# EAGLE design clk_module (EAGLE 6.5.0)
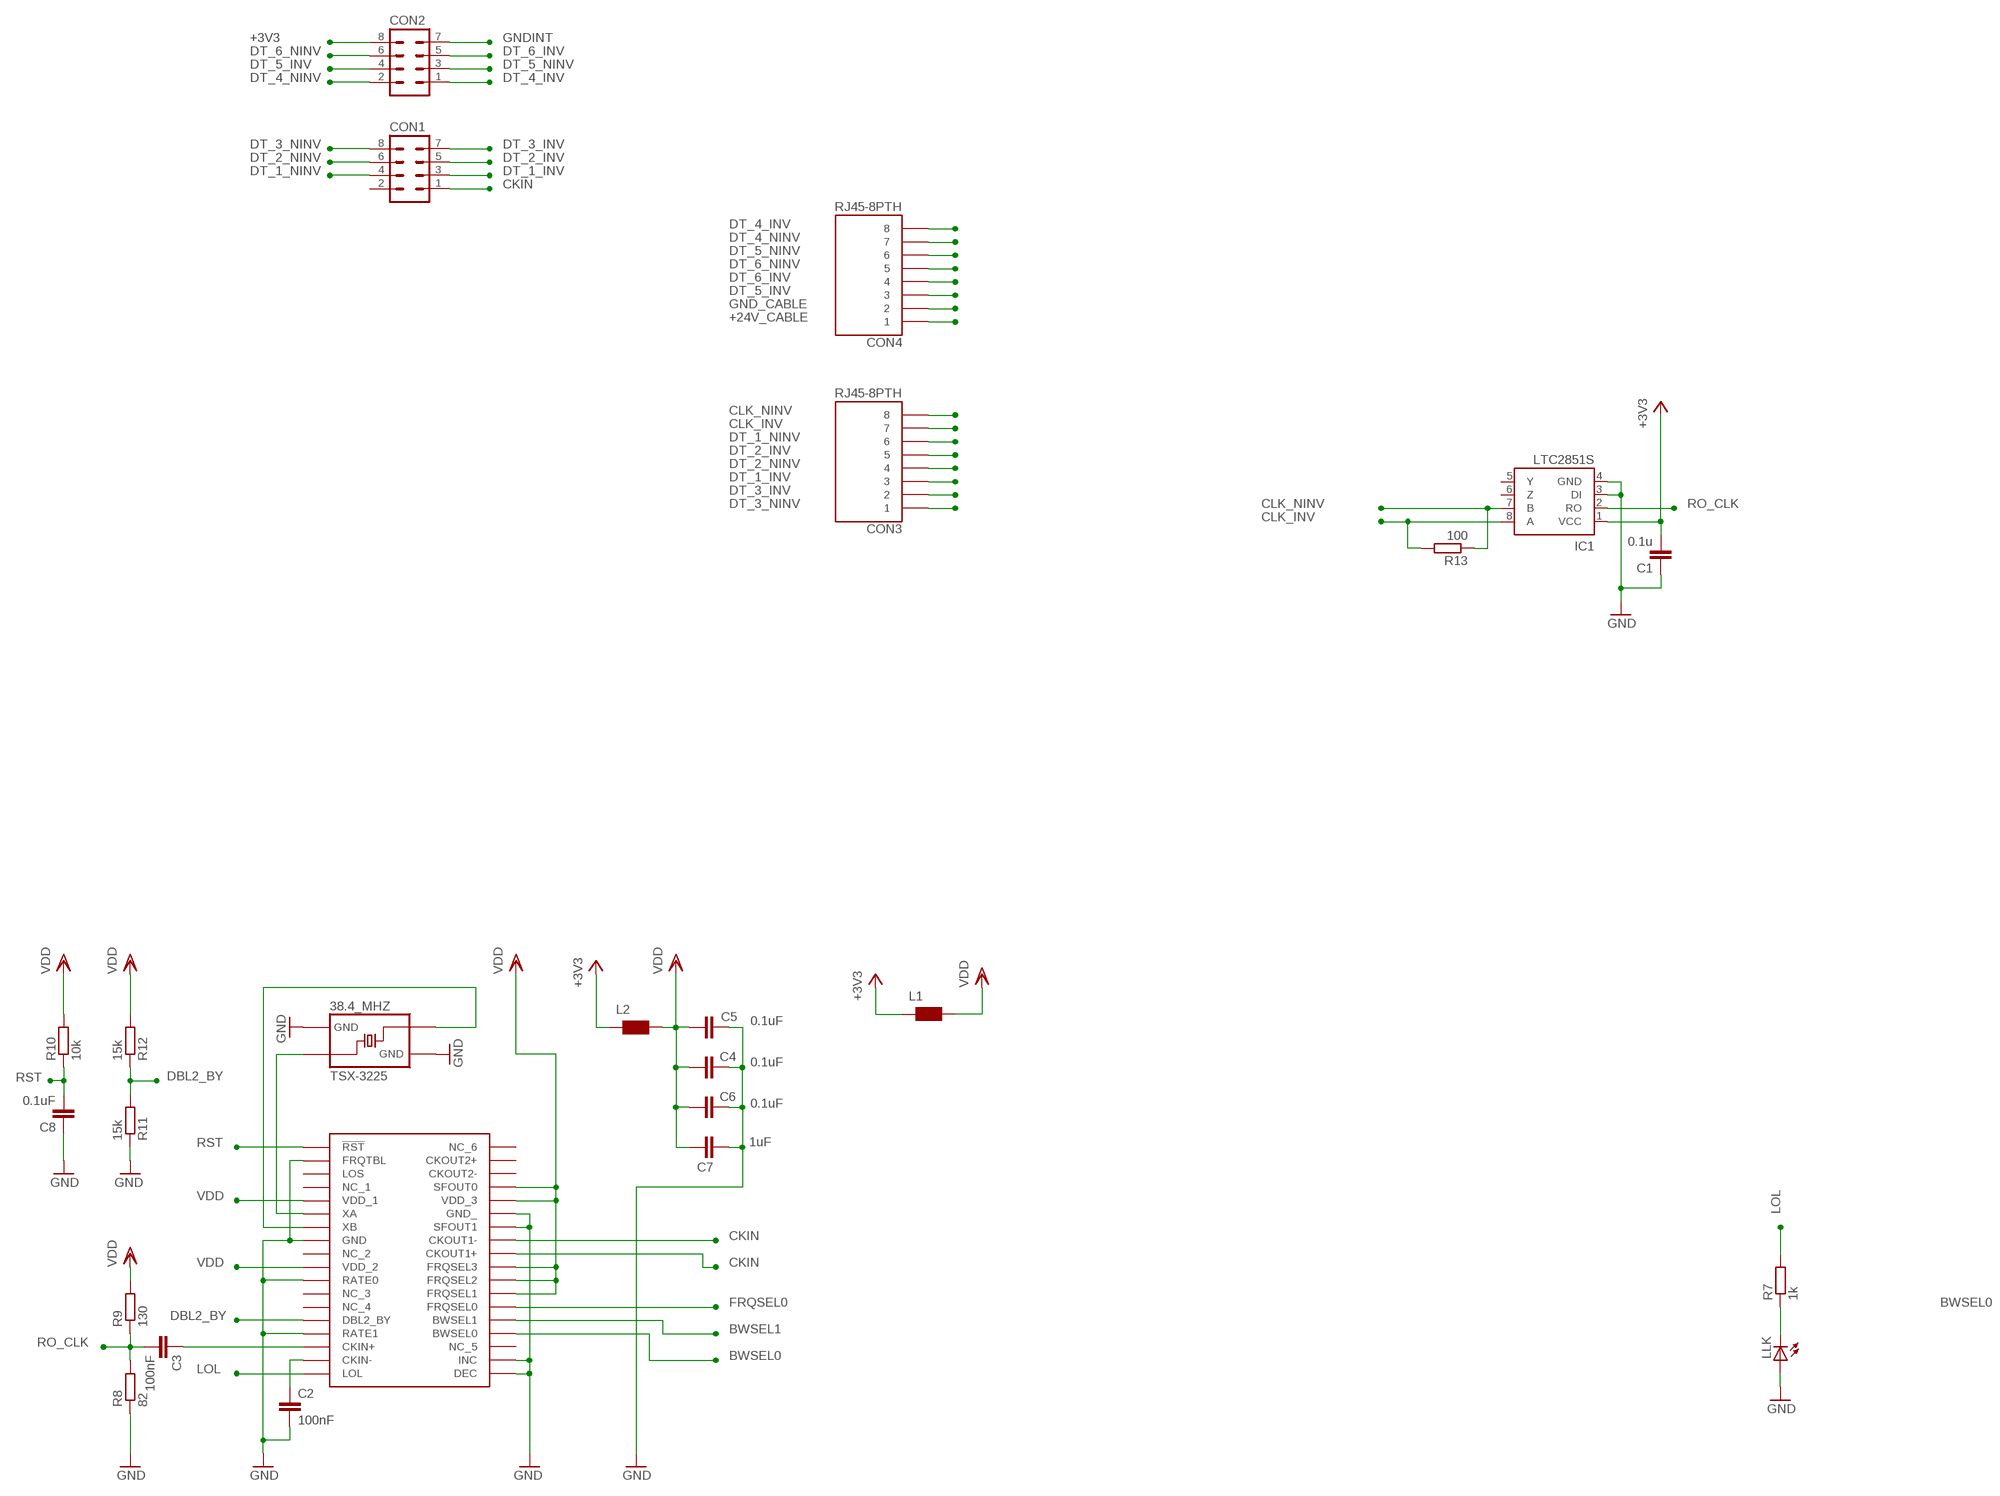
[diagram p0: schematic, sheet 1, part 1 of 2]
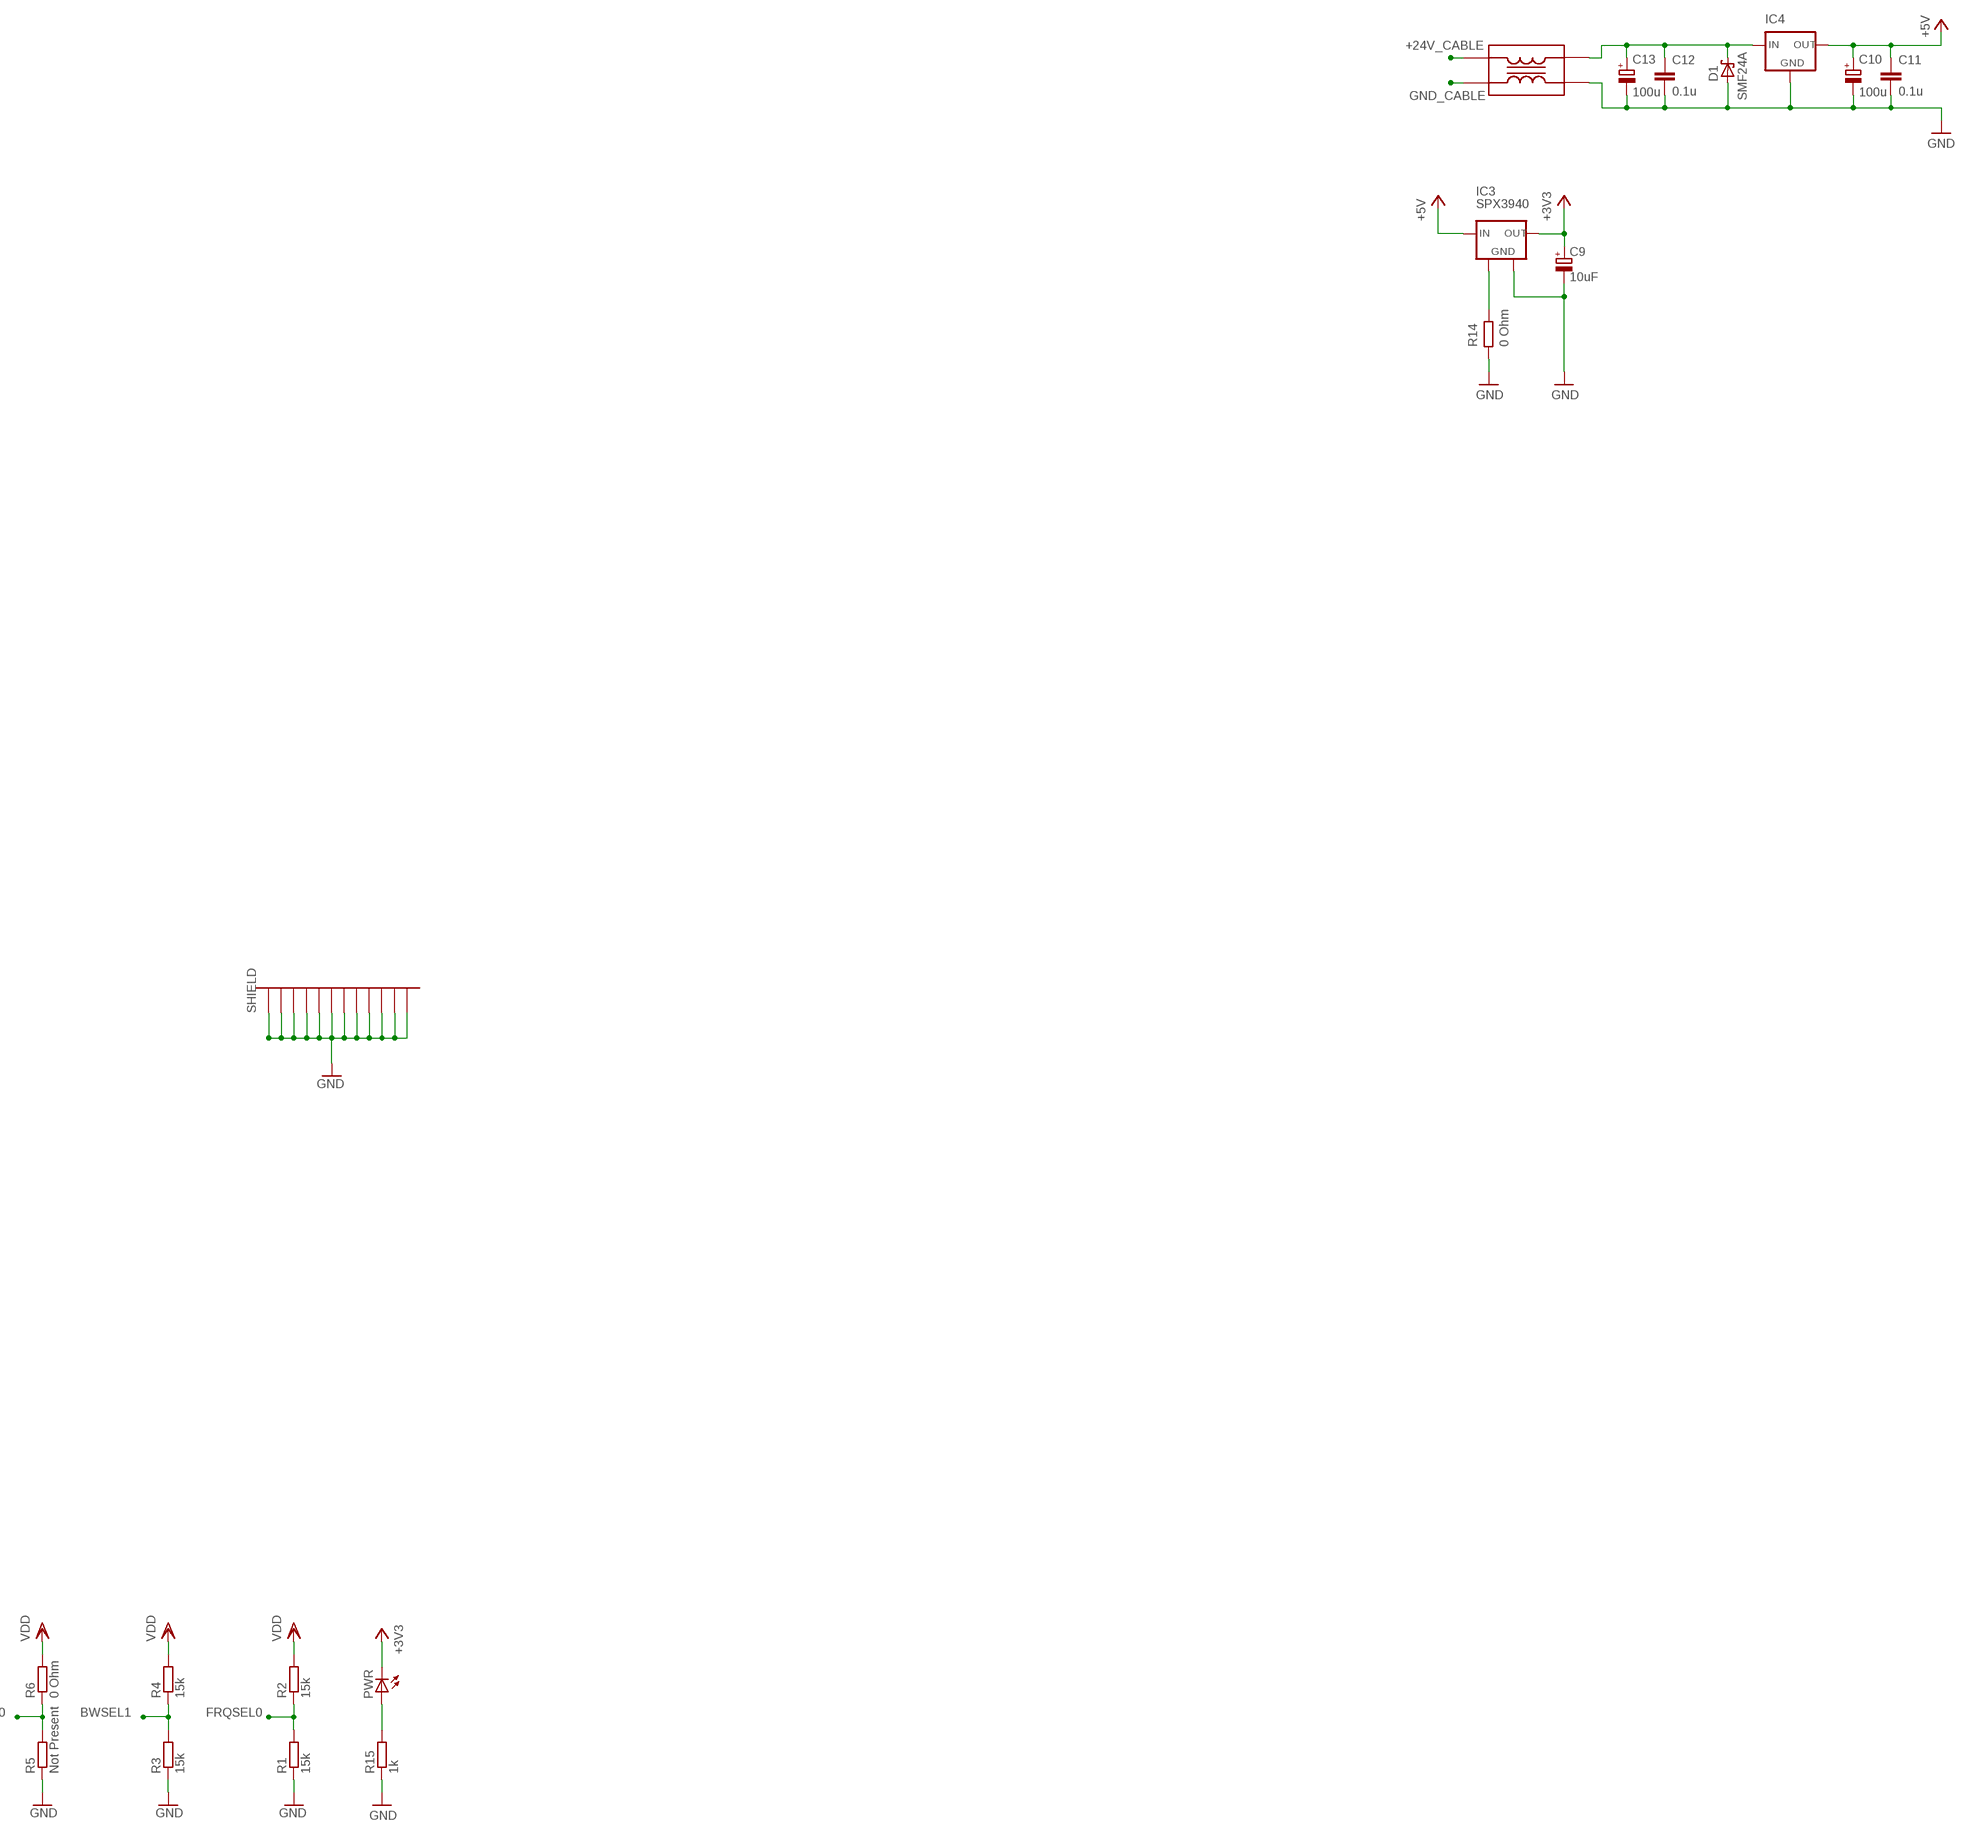
[diagram p1: schematic, sheet 1, part 2 of 2]

## Parts
38.4_MHZ  TSX-3225  [TSX-3225]
C1  0.1u  C-EUC0805  [C0805]
C2  100nF  C-EUC0402  [C0402]
C3  100nF  C-EUC0402  [C0402]
C4  0.1uF  C-EUC0402  [C0402]
C5  0.1uF  C-EUC0402  [C0402]
C6  0.1uF  C-EUC0402  [C0402]
C7  1uF  C-EUC0402  [C0402]
C8  0.1uF  C-EUC0402  [C0402]
C9  10uF  CPOL-EUE2-5  [E2-5]
C10  100u  CPOL-EUE5-10.5  [E5-10,5]
C11  0.1u  C-EUC0805  [C0805]
C12  0.1u  C-EUC0805  [C0805]
C13  100u  CPOL-EUE5-10.5  [E5-10,5]
CON1  MA04-2  [MA04-2]
CON2  MA04-2  [MA04-2]
CON3  RJ45-8PTH  [RJ45-8]
CON4  RJ45-8PTH  [RJ45-8]
D1  SMF24A  [SOD123]
IC1  LTC2851S  [SOIC8]
IC2  SI5317  [QFN-36]
IC3  SPX3940  [SOT223]
IC4  V_REG_OKI-78SRSINK  [TO220-IGO]
L1  WE-CBF_0805  [0805]
L2  WE-CBF_0805  [0805]
L3  ACM3225-601-2P-T001  [ACM3225-601-2P-T001]
LLK  LEDCHIPLED_0805  [CHIPLED_0805]
PWR  LEDCHIPLED_0805  [CHIPLED_0805]
R1  15k  R-EU_R0603  [R0603]
R2  15k  R-EU_R0603  [R0603]
R3  15k  R-EU_R0603  [R0603]
R4  15k  R-EU_R0603  [R0603]
R5  Not Present  R-EU_R0603  [R0603]
R6  0 Ohm  R-EU_R0603  [R0603]
R7  1k  R-EU_R0603  [R0603]
R8  82  R-EU_R0603  [R0603]
R9  130  R-EU_R0603  [R0603]
R10  10k  R-EU_R0402  [R0402]
R11  15k  R-EU_R0603  [R0603]
R12  15k  R-EU_R0603  [R0603]
R13  100  R-EU_R0603  [R0603]
R14  0 Ohm  R-EU_R0805  [R0805]
R15  1k  R-EU_R0603  [R0603]
SH1  BMIS-202  [BMIS-202]

## Nets
24V_IN: C12.1 C13.+ D1.C IC4.IN L3.4
+3V3: C1.2 C9.+ CON2.8 IC1.1(VCC) IC3.3(OUT) L1.1 L2.1 PWR.C
+5V: C10.+ C11.1 IC3.1(IN) IC4.OUT
+24V_CABLE: CON4.1 L3.1
BWSEL0: IC2.22(BWSEL0) R5.2 R6.1
BWSEL1: IC2.23(BWSEL1) R3.2 R4.1
CKIN: CON1.1 IC2.28(CKOUT1+) IC2.29(CKOUT1-)
CKIN+: C3.1 IC2.16(CKIN+)
CKIN-: C2.1 IC2.17(CKIN-)
CLK_INV: CON3.7 IC1.8(A) R13.2
CLK_NINV: CON3.8 IC1.7(B) R13.1
DBL2_BY: IC2.14(DBL2_BY) R11.2 R12.1
DT_1_INV: CON1.3 CON3.3
DT_1_NINV: CON1.4 CON3.6
DT_2_INV: CON1.5 CON3.5
DT_2_NINV: CON1.6 CON3.4
DT_3_INV: CON1.7 CON3.2
DT_3_NINV: CON1.8 CON3.1
DT_4_INV: CON2.1 CON4.8
DT_4_NINV: CON2.2 CON4.7
DT_5_INV: CON2.4 CON4.3
DT_5_NINV: CON2.3 CON4.6
DT_6_INV: CON2.5 CON4.4
DT_6_NINV: CON2.6 CON4.5
FRQSEL0: IC2.24(FRQSEL0) R1.2 R2.1
GND: 38.4_MHZ.PIN_2(GND_2) 38.4_MHZ.PIN_4(GND_1) C1.1 C2.2 C4.1 C5.1 C6.1 C7.1 C8.1 IC1.3(DI) IC1.4(GND) IC2.2(FRQTBL) IC2.8(GND) IC2.11(RATE0) IC2.15(RATE1) IC2.19(DEC) IC2.20(INC) IC2.30(SFOUT1) IC2.31(GND_) LLK.A R1.1 R3.1 R5.1 R8.1 R11.1 R14.1 SH1.P$1(GND) SH1.P$2(GND) SH1.P$3(GND) SH1.P$4(GND) SH1.P$5(GND) SH1.P$6(GND) SH1.P$7(GND) SH1.P$8(GND) SH1.P$9(GND) SH1.P$10(GND) SH1.P$11(GND) SH1.P$12(GND)
GND_CABLE: CON4.2 L3.2
GNDINT: C9.- C10.- C11.2 C12.2 C13.- CON2.7 D1.A IC3.2(GND) IC3.4(GND) IC4.GND L3.3 R14.2 R15.1 ; supply symbol labelled GND
LOL: IC2.18(LOL) R7.2
N$1: PWR.A R15.2
N$11: LLK.C R7.1
RO_CLK: C3.2 IC1.2(RO) R8.2 R9.1
RST: C8.2 IC2.1(!RST) R10.1
VDD: C4.2 C5.2 C6.2 C7.2 IC2.5(VDD_1) IC2.10(VDD_2) IC2.25(FRQSEL1) IC2.26(FRQSEL2) IC2.27(FRQSEL3) IC2.32(VDD_3) IC2.33(SFOUT0) L2.2 R10.2 R12.2
VDD_2: L1.2 R2.2 R4.2 R6.2 R9.2 ; supply symbol labelled VDD
XA: 38.4_MHZ.PIN_1(CON_1) IC2.6(XA)
XB: 38.4_MHZ.PIN_3(CON_2) IC2.7(XB)
Unconnected: CON1.2 IC1.5(Y) IC1.6(Z) IC2.3(LOS) IC2.4(NC_1) IC2.9(NC_2) IC2.12(NC_3) IC2.13(NC_4) IC2.21(NC_5) IC2.34(CKOUT2-) IC2.35(CKOUT2+) IC2.36(NC_6)

## Power pins joined to a net without a drawn wire
GND: IC2.GND_PAD(GND) IC2.GND_VIA_1(GND) IC2.GND_VIA_2(GND) IC2.GND_VIA_3(GND) IC2.GND_VIA_4(GND) IC2.GND_VIA_5(GND)

## Library data of the parts
38.4_MHZ = texas_lvds:TSX-3225: MHz Range Crystal Unit Miniature Size Low Profile SMD
C1-C8 C11 C12 = rcl:C-EU: CAPACITOR, European symbol
C9 C10 C13 = rcl:CPOL-EU: POLARIZED CAPACITOR, European symbol
CON1 CON2 = con-lstb:MA04-2: PIN HEADER; OC_FARNELL: unknown; OC_NEWARK: unknown
CON3 CON4 = SparkFun:RJ45-8: RJ45 Jack Simple RJ45, 8-pin connection - connector for common Cat5, Cat5e, and Cat6 Ethernet cables. Footprint not yet proven in production. Connector sku is PRT-00643; Breakout PCB sku is BOB-00716.
D1 = texas_lvds:SMF24A: TVS DIODE 200W SOD-123F 24V UNI by Littelfuse Inc
IC1 = texas_lvds:LTC2851: 3.3V 20Mbps RS485/RS422 Transceiver - Full Duplex no Enable Source: http://cds.linear.com/docs/Datasheet/285012fd.pdf
IC2 = texas_lvds:SI5317: Jitter attenuation without clock multiplication.
IC3 = texas_lvds:SPX3940: Voltage regulator with a low drop out voltage of 280mV (typical) at 1A
IC4 = texas_lvds:V_REG_OKI-78SR: Voltage Regulator Standard 7805 5V regulator. IGO (Input Ground Output). Spark Fun Electronics SKU : COM-00107
L1 L2 = wuerth-elektronik:WE-CBF: SMD EMI Suppression Ferrite Beads - excellent anti-EMI properties - low DCR - impedances till 3000 ohms - rated current up to 6 A
L3 = texas_lvds:ACM3225-601-2P-T001: TDK Common Mode Filter For High-speed Differential Signal Line / General Signal Line
LLK PWR = led:LED: LED OSRAM: - CHIPLED LG R971, LG N971, LY N971, LG Q971, LY Q971, LO R971, LY R971 LH N974, LH R974 LS Q976, LO Q976, LY Q976 LO Q996 - Hyper CHIPLED LW Q18S LB Q993, LB Q99A, LB R99A - SideLED LS A670, LO A670, LY A670, LG A670, LP A670 LB A673, LV A673, LT A673, LW A673 LH A674 LY A675 LS A676, LA A676, LO A676, LY A676, LW A676 LS A679, LY A679, LG A679 - Hyper Micro SIDELED® LS Y876, LA Y876, LO Y876, LY Y876 LT Y87S - SmartLED LW L88C, LW L88S LB L89C, LB L89S, LG L890 LS L89K, LO L89K, LY L89K LS L896, LA L896, LO L896, LY L896 - TOPLED LS T670, LO T670, LY T670, LG T670, LP T670 LSG T670, LSP T670, LSY T670, LOP T670, LYG T670 LG T671, LOG T671, LSG T671 LB T673, LV T673, LT T673, LW T673 LH T674 LS T676, LA T676, LO T676, LY T676, LB T676, LH T676, LSB T676, LW T676 LB T67C, LV T67C, LT T67C, LS T67K, LO T67K, LY T67K, LW E67C LS E67B, LA E67B, LO E67B, LY E67B, LB E67C, LV E67C, LT E67C LW T67C LS T679, LY T679, LG T679 LS T770, LO T770, LY T770, LG T770, LP T770 LB T773, LV T773, LT T773, LW T773 LH T774 LS E675, LA E675, LY E675, LS T675 LS T776, LA T776, LO T776, LY T776, LB T776 LHGB T686 LT T68C, LB T68C - Hyper Mini TOPLED® LB M676 - Mini TOPLED Santana® LG M470 LS M47K, LO M47K, LY M47K Source: http://www.osram.convergy.de LUXEON: - LUMILED® LXK2-PW12-R00, LXK2-PW12-S00, LXK2-PW14-U00, LXK2-PW14-V00 LXK2-PM12-R00, LXK2-PM12-S00, LXK2-PM14-U00 LXK2-PE12-Q00, LXK2-PE12-R00, LXK2-PE12-S00, LXK2-PE14-T00, LXK2-PE14-U00 LXK2-PB12-K00, LXK2-PB12-L00, LXK2-PB12-M00, LXK2-PB14-N00, LXK2-PB14-P00, LXK2-PB14-Q00 LXK2-PR12-L00, LXK2-PR12-M00, LXK2-PR14-Q00, LXK2-PR14-R00 LXK2-PD12-Q00, LXK2-PD12-R00, LXK2-PD12-S00 LXK2-PH12-R00, LXK2-PH12-S00 LXK2-PL12-P00, LXK2-PL12-Q00, LXK2-PL12-R00 Source: www.luxeon.com KINGBRIGHT: KA-3528ASYC Source: www.kingbright.com
R1-R6 R8 R9 R11 R12 = resistor:R-EU_: RESISTOR, European symbol
R7 R10 R13-R15 = rcl:R-EU_: RESISTOR, European symbol
SH1 = laird:BMIS-202: Laird BMI-S-202 EMI Shield

## Board
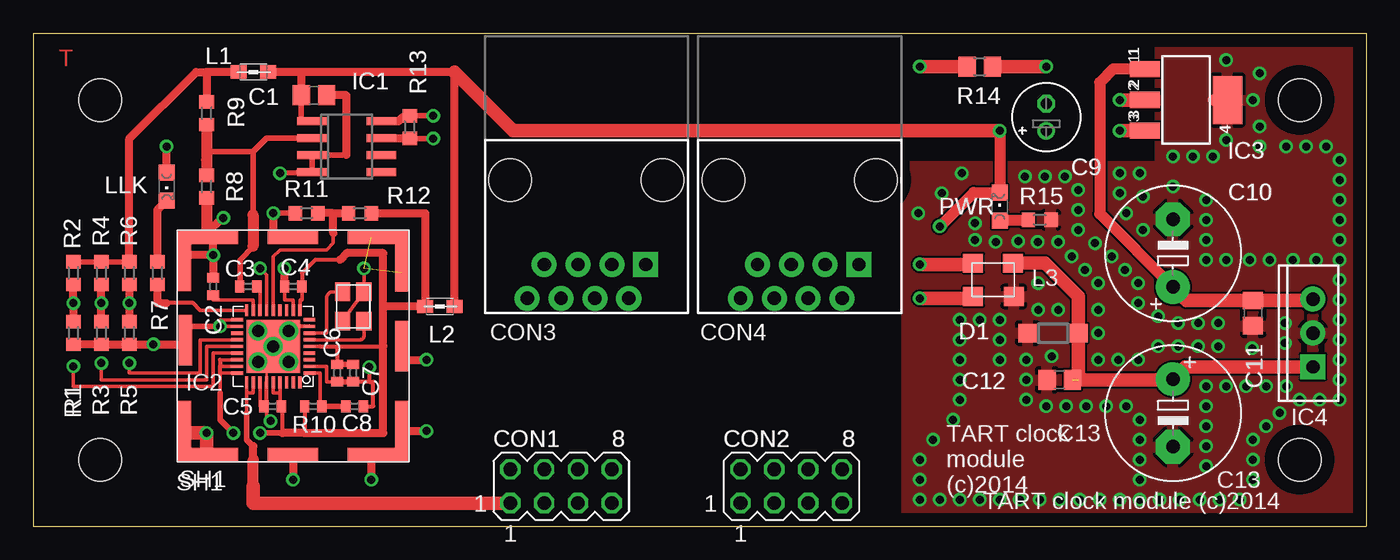
[diagram p2: board, top side]
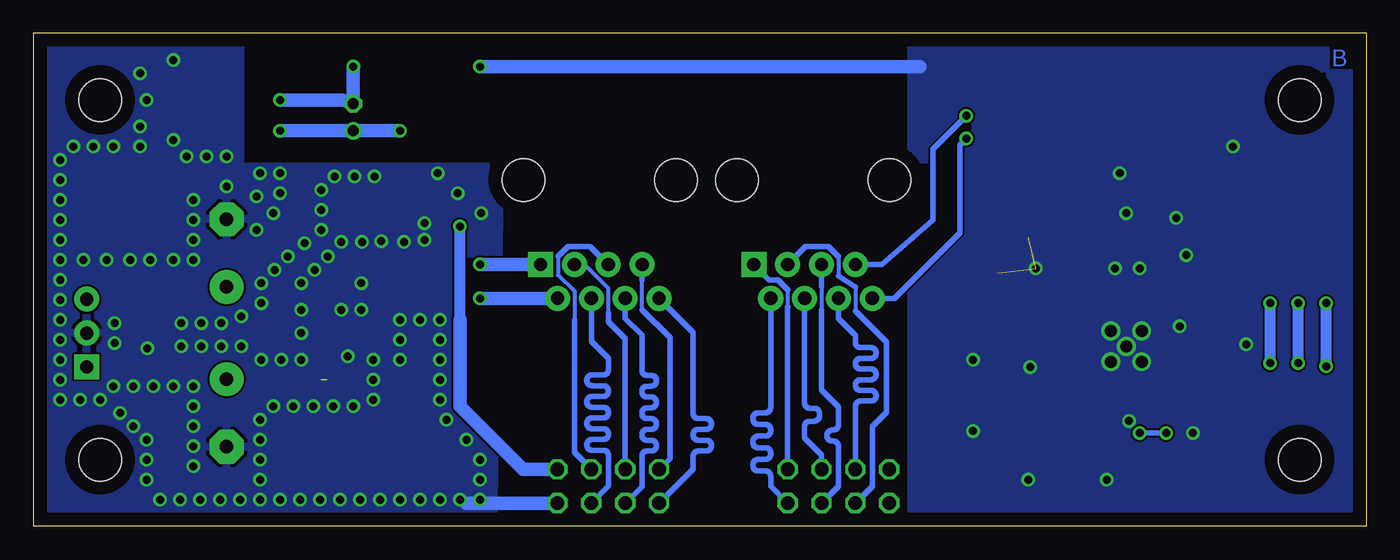
[diagram p3: board, bottom side, seen from below]

Size 100 x 37 mm. Coordinates in mm from the lower left corner, seen from the top.
Outline: 0,37 0,0 100,0 100,37 0,37
Copper layers (1*16): Top 0.035mm / dielectric 1.5mm / Bottom 0.035mm
Design rules "default *": minimum track width 0.25mm, minimum drill 0.6mm, track to track 6mil, track to pad 6mil, pad to pad 6mil, via to via 6mil, smd to smd 6mil, copper to edge 40mil, drill to drill 8mil, minimum pad ring 10mil, minimum via ring 8mil, stop-mask expansion 4mil, vias tented up to drill 0.7mm, thermal gap 10mil
Holes 3.2 mm at 5,5 5,32 95,5 95,32

### Footprints (pad centres in the part's own frame; a part is rotated, then mirrored left to right if it is on the bottom)
TSX-3225 = smd 1.4 x 1.15: PIN_1 -1.1,-0.8; PIN_2 1.1,-0.8; PIN_3 1.1,0.8; PIN_4 -1.1,0.8
C0805 = smd 1.3 x 1.5: 1 -0.95,0; 2 0.95,0
C0402 = smd 0.7 x 0.9: 1 -0.65,0; 2 0.65,0
E2-5 = drill 0.813 pad 1.27: + -1.016,0 | drill 0.813 pad 1.27 octagon: - 1.016,0
E5-10,5 = drill 1.016 pad 2.54: + -2.54,0 | drill 1.016 pad 2.54 octagon: - 2.54,0
MA04-2 = drill 1.016 octagon: 1 -3.81,-1.27; 2 -3.81,1.27; 3 -1.27,-1.27; 4 -1.27,1.27; 5 1.27,-1.27; 6 1.27,1.27; 7 3.81,-1.27; 8 3.81,1.27
RJ45-8 = drill 1 pad 1.88 square: 1 -4.445,6.35 | drill 1 pad 1.88: 2 -3.175,8.89; 3 -1.905,6.35; 4 -0.635,8.89; 5 0.635,6.35; 6 1.905,8.89; 7 3.175,6.35; 8 4.445,8.89 | hole 3.2: -5.715,0; 5.715,0
SOD123 = smd 1.4 x 1.4: A 1.9,0; C -1.9,0
SOIC8 = smd 0.6 x 2.2: 1 -1.905,-2.6; 2 -0.635,-2.6; 3 0.635,-2.6; 4 1.905,-2.6; 5 1.905,2.6; 6 0.635,2.6; 7 -0.635,2.6; 8 -1.905,2.6
QFN-36 = smd 0.89 x 0.25: 1 -2.71,2; 2 -2.71,1.5; 3 -2.71,1; 4 -2.71,0.5; 5 -2.71,0; 6 -2.71,-0.5; 7 -2.71,-1; 8 -2.71,-1.5; 9 -2.71,-2; 19 2.71,-2; 20 2.71,-1.5; 21 2.71,-1; 22 2.71,-0.5; 23 2.71,0; 24 2.71,0.5; 25 2.71,1; 26 2.71,1.5; 27 2.71,2 | smd 0.25 x 0.89: 10 -2,-2.71; 11 -1.5,-2.71; 12 -1,-2.71; 13 -0.5,-2.71; 14 0,-2.71; 15 0.5,-2.71; 16 1,-2.71; 17 1.5,-2.71; 18 2,-2.71; 28 2,2.71; 29 1.5,2.71; 30 1,2.71; 31 0.5,2.71; 32 0,2.71; 33 -0.5,2.71; 34 -1,2.71; 35 -1.5,2.71; 36 -2,2.71 | smd 4 x 4: GND_PAD 0,0 | drill 0.9: GND_VIA_1 -1.15,1.15; GND_VIA_2 1.15,1.15; GND_VIA_3 0,0; GND_VIA_4 -1.15,-1.15; GND_VIA_5 1.15,-1.15
SOT223 = smd 1.219 x 2.235: 1 -2.311,-3.099; 2 0,-3.099; 3 2.311,-3.099 | smd 3.6 x 2.2: 4 0,3.099
TO220-IGO = drill 1 pad 1.88: GND 0,0; OUT 2.54,0 | drill 1 pad 1.88 square: IN -2.54,0
0805 = smd 1.2 x 1: 1 -1.1,0; 2 1.1,0
ACM3225-601-2P-T001 = smd 1.5 x 1.4: 1 -1.5,1.25; 2 -1.5,-1.25; 3 1.55,-1.25; 4 1.5,1.25
CHIPLED_0805 = smd 1.2 x 1.2: A 0,-1.05; C 0,1.05
R0603 = smd 1 x 1.1: 1 -0.85,0; 2 0.85,0
R0402 = smd 0.7 x 0.9: 1 -0.65,0; 2 0.65,0
R0805 = smd 1.3 x 1.5: 1 -0.95,0; 2 0.95,0
BMIS-202 = smd 1 x 4.55: P$1 -7.675,-6.35; P$2 -7.675,6.425; P$3 8.625,6.4; P$4 8.625,-6.35 | smd 1 x 3.8: P$5 -7.6,0.475; P$7 8.625,0.025 | smd 3.8 x 1: P$6 0.475,8.2; P$8 0.475,-8.125 | smd 3.55 x 1: P$9 -5.4,-8.125; P$10 -5.4,8.2; P$11 6.35,8.175; P$12 6.35,-8.125

### Placement (x,y rotation side)
38.4_MHZ  24,16.5 90 top
C1  21.06,32.34 180 top
C2  13.5,18 90 top
C3  16.14,18 180 top
C4  19.5,18 0 top
C5  17.95,9 0 top
C6  22.8,11.5 90 top
C7  24,11.5 90 top
C8  24.1,9 180 top
C9  76,30.7 90 top
C10  85.5,20.5 90 top
C11  91.5,16 270 top
C12  77,11 180 top
C13  85.5,8.5 270 top
CON1  39.59,3 0 top
CON2  56.87,3 0 top
CON3  41.5,26 180 top
CON4  57.5,26 180 top
D1  76.5,14.5 180 top
IC1  23.5,28.5 270 top
IC2  18,13.5 180 top
IC3  86.5,32 270 top
IC4  96,14.5 90 top
L1  16.5,34.1 180 top
L2  30.5,16.5 180 top
L3  72,18.5 0 top
LLK  10,25.5 180 top
PWR  72.5,24 0 top
R1  3,14.5 90 top
R2  3,19 90 top
R3  5.1,14.5 90 top
R4  5.1,19 90 top
R5  7.2,14.5 90 top
R6  7.2,19 90 top
R7  9.3,19 270 top
R8  13,25.5 90 top
R9  13,31 90 top
R10  21,9 180 top
R11  20.5,23.5 0 top
R12  24.5,23.5 0 top
R13  28.24,29.96 90 top
R14  71,34.5 0 top
R15  75.5,23 180 top
SH1  19,13.5 0 top

### Tracks (layer width: path | path; a pad name or v marks a point on that pad's centre or on a via)
24V_IN  (1 unrouted)
  Top 1.016: L3.4 75.9,19.75 78.4,17.25 D1.C 78.4,11 | C12.1 85.46,11 C13.+ 86.42,11.96 IC4.IN
+3V3  (via drill 0.6)
  Top 0.406: IC1.1 20.11,30.41 C1.2
  Top 0.61: L2.1 31.6,34.1 20.11,34.1 | 20.11,34.1 C1.2 | 20.11,34.1 L1.1
  Top 0.813: v72.5,29.69 PWR.C 70.55,25.05 v68,22.5
  Top 1.016: v81.5,29.69 IC3.3 | 31.6,34.1 36.01,29.69 v72.5,29.69
  Bottom 0.813: 68,15.5 v68,22.5
  Bottom 1.016: CON2.8 63.27,4.27 68,9 68,15.5 | v81.5,29.69 C9.+ v72.5,29.69
+5V
  Top 0.813: IC3.1 81,34.31 80,33.31 80,23.46 C10.+
  Top 1.016: C10.+ 86.51,16.95 C11.1 95.91,16.95 IC4.OUT
+24V_CABLE  (via drill 0.6)
  Top 0.406: 70.5,19.65 L3.1
  Top 1.016: v66.5,19.65 70.5,19.65
  Bottom 1.016: v66.5,19.65 CON4.1
BWSEL0  (via drill 0.6)
  Top 0.254: IC2.22 12.5,14 12.5,11.5 7.2,11.5 v7.2,12.25
  Top 0.61: R6.1 v7.2,16.75 R5.2
  Bottom 0.813: v7.2,12.25 v7.2,16.75
BWSEL1  (via drill 0.6)
  Top 0.254: IC2.23 13,13.5 13,11 5.1,11 v5.1,12.25
  Top 0.61: R3.2 v5.1,16.75 R4.1
  Bottom 0.813: v5.1,12.25 v5.1,16.75
CKIN
  Top 0.254: IC2.28 16,10 | 16,10 16,8.5 | IC2.29 16.5,10 16,10
  Top 0.406: 16,8.5 16,6.5 16.5,6
  Top 0.61: 16.5,5 16.5,6
  Top 0.813: 16.5,3 16.5,5
  Top 1.016: 16.5,3 16.5,1.73 CON1.1
CKIN+
  Top 0.254: IC2.16 17,18 C3.1
CKIN-
  Top 0.254: IC2.17 16.5,17 13.5,17 C2.1
CLK_INV  (via drill 0.6)
  Top 0.406: R13.2 v30,30.81
  Top 0.61: IC1.8 27.41,30.41 27.7,30.7 28.13,30.7 R13.2
  Bottom 0.406: CON3.7 36.35,19.65 32.5,23 32.5,28.31 v30,30.81
CLK_NINV  (via drill 0.6)
  Top 0.406: R13.1 v30,29.11
  Top 0.61: IC1.7 28.21,29.14 R13.1
  Bottom 0.406: v30,29.11 30.5,28.61 30.5,22 35.39,17.11 CON3.8
DBL2_BY
  Top 0.254: IC2.14 18,20.25 18.5,20.75 22,20.75 22.5,21.25 22.5,22
  Top 0.61: 22.5,22 22.5,23.5 | 22.5,23.5 R11.2 | 22.5,23.5 R12.1
DT_1_INV
  Bottom 0.305: 39.6,20.25 39.6,18.8 | 38.33,17.98 38.33,16.17
  Bottom 0.406: CON3.3 42.05,21 40.35,21 39.6,20.25 | 39.6,18.8 38.33,17.98 | 38.33,16.17 36,13.84 36,8.55 37.05,7.5 37.05,3 CON1.3
DT_1_NINV
  Bottom 0.406: CON3.6 39.59,15.6 38.33,14.32 38.33,13.8 arc-90 37.93,13.4 37.16,13.4 arc90 36.76,13.01 36.76,12.99 arc90 37.16,12.6 37.93,12.6 arc-90 38.33,12.21 38.33,12.19 arc-90 37.93,11.8 37.16,11.8 arc90 36.76,11.4 36.76,11.39 arc90 37.16,11 37.93,11 arc-90 38.33,10.6 38.33,10.59 arc-90 37.93,10.2 37.16,10.2 arc90 36.76,9.8 36.76,9.79 arc90 37.16,9.39 37.93,9.39 arc-90 38.33,9 CON1.4
DT_2_INV
  Bottom 0.305: 40.87,18 40.87,16.25
  Bottom 0.406: CON3.5 40.87,18 | 40.87,16.25 40.87,10.21 39.6,8.95 39.6,7.61 arc90 39.99,7.21 40.06,7.21 arc-90 40.45,6.82 40.45,6.79 arc-90 40.06,6.39 39.99,6.39 arc90 39.6,6 39.6,3 CON1.5
DT_2_NINV
  Bottom 0.406: CON1.6 40.87,5.37 42.13,6.63 42.13,7.49 arc90 41.74,7.88 41.41,7.88 arc-90 41.02,8.28 41.02,8.46 arc-90 41.41,8.86 41.74,8.86 arc90 42.13,9.25 CON3.4
DT_3_INV
  Bottom 0.406: CON3.2 44.67,8.91 arc90 45.07,8.51 45.62,8.51 arc-90 46.01,8.12 46.01,8.03 arc-90 45.62,7.64 45.07,7.64 arc90 44.67,7.25 44.67,7.16 arc90 45.07,6.76 45.62,6.76 arc-90 46.01,6.37 46.01,6.29 arc-90 45.62,5.89 45.07,5.89 arc90 44.67,5.5 44.67,5.41 arc90 45.07,5.02 45.62,5.02 arc-90 46.01,4.62 46.01,4.54 arc-90 45.62,4.14 45.07,4.14 arc90 44.67,3.75 44.67,3 CON1.7
DT_3_NINV
  Bottom 0.305: 43.4,16.45 43.4,17.75
  Bottom 0.406: CON3.1 44.8,18.5 44.15,18.5 43.4,17.75 | 43.4,16.45 43.41,16.45 CON1.8
DT_4_INV
  Bottom 0.406: CON2.1 50.5,4.29 50.5,5.25 arc90 50.11,5.64 49.52,5.64 arc-90 49.12,6.04 49.12,6.06 arc-90 49.52,6.46 50.11,6.46 arc90 50.5,6.85 50.5,6.88 arc90 50.11,7.27 49.52,7.27 arc-90 49.12,7.66 49.12,7.69 arc-90 49.52,8.08 50.11,8.08 arc90 50.5,8.47 50.5,14.55 CON4.8
DT_4_NINV
  Bottom 0.305: 54.33,16.25 54.33,18.5
  Bottom 0.406: 54.33,18.5 CON4.7 | CON2.2 52.25,5.08 52.25,14.18 54.33,16.25
DT_5_INV
  Bottom 0.305: 58.65,19.65 56.85,17.85 56.85,16
  Bottom 0.406: CON4.3 58.65,19.65 | CON2.4 55.59,14.1 56.85,15.35 56.85,16
DT_5_NINV
  Bottom 0.406: CON4.6 55.59,15.6 54.35,14.35 54.35,11.72 arc-90 53.96,11.32 53.65,11.32 arc90 53.25,10.93 53.25,10.9 arc90 53.65,10.51 53.96,10.51 arc-90 54.35,10.12 54.35,10.09 arc-90 53.96,9.7 53.65,9.7 arc90 53.25,9.31 53.25,9.28 arc90 53.65,8.89 53.96,8.89 arc-90 54.35,8.49 54.35,8.47 arc-90 53.96,8.08 53.65,8.08 arc90 53.25,7.68 53.25,7.66 arc90 53.65,7.27 53.96,7.27 arc-90 54.35,6.87 54.35,6.85 arc-90 53.96,6.46 53.65,6.46 arc90 53.25,6.06 53.25,6.04 arc90 53.65,5.64 53.96,5.64 arc-90 54.35,5.25 54.35,2.98 CON2.3
DT_6_INV
  Bottom 0.406: CON4.4 58.13,13.88 56.85,12.6 56.85,11.75 arc90 57.24,11.36 58.09,11.36 arc-90 58.48,10.96 58.48,10.94 arc-90 58.09,10.55 57.24,10.55 arc90 56.85,10.15 56.85,10.13 arc90 57.24,9.74 58.09,9.74 arc-90 58.48,9.35 58.48,9.33 arc-90 58.09,8.93 57.24,8.93 arc90 56.85,8.54 56.85,8.52 arc90 57.24,8.13 58.09,8.13 arc-90 58.48,7.73 58.48,7.71 arc-90 58.09,7.32 57.24,7.32 arc90 56.85,6.93 56.85,6.91 arc90 57.24,6.51 58.09,6.51 arc-90 58.48,6.12 58.48,6.1 arc-90 58.09,5.7 57.24,5.7 arc90 56.85,5.31 56.85,3.02 CON2.5
DT_6_NINV
  Bottom 0.305: 60.65,20.25 60.65,18.85 59.4,17.65 59.4,15.5
  Bottom 0.406: CON4.5 58.22,21 59.9,21 60.65,20.25 | 59.4,15.5 59.4,5.54 CON2.6
FRQSEL0  (via drill 0.6)
  Top 0.254: IC2.24 13.5,13 13.5,10.5 3,10.5 v3,12
  Top 0.61: R2.1 v3,16.75 R1.2
  Bottom 0.813: v3,12 v3,16.75
GND  (via drill 0.6)  (2 unrouted)
  Top 0.25: 28,20 SH1.P$3 | 11,14 SH1.P$5 | 18,14 17,14 IC2.GND_VIA_5 | 18,14 19,14 IC2.GND_VIA_4 | 18,14 IC2.GND_VIA_3 18,13 19,13 IC2.GND_VIA_1
  Top 0.254: IC2.2 22,12 22,10.85 C6.1 | IC2.20 v14,15 14,15.5 IC2.19 | IC2.11 19.5,17 18.85,17 C4.1 | IC2.30 17,9 C5.1 17.5,9 17.5,8.3 v17.8,7.9 | IC2.15 17.5,18.85 v17,19.35 | 38.4_MHZ.PIN_2 v24.8,19.35
  Top 0.3: 17.5,9 IC2.31 | IC2.8 19.15,15 IC2.GND_VIA_4
  Top 0.305: 38.4_MHZ.PIN_4 38.4_MHZ.PIN_2 | C8.1 25.5,9 25.5,10.85 25.2,10.85 | 25.2,10.85 C7.1 | v25.2,11.95 25.2,10.85
  Top 0.406: C6.1 C7.1 | v14,15 11.4,15 SH1.P$5 | v18.5,26.5 IC1.4 IC1.3 23.5,27.86 | R11.1 v18,23.5
  Top 0.61: SH1.P$9 13,5.38 | SH1.P$7 27.62,12.5 v29.5,12.5 | 23.5,27.86 23.5,32.34 C1.1 | v18,23.5 18,21.7 SH1.P$6 | SH1.P$5 11.4,13.65 v9,13.65 R5.1 R3.1 R1.1 | LLK.A v10,28.5 | v14.25,23.15 14.15,23.15 13,22 | v13.5,20.35 C2.2 | v13.5,20.35 11.32,20.35 SH1.P$2 | v13.5,20.35 13.5,21.7 SH1.P$10 | C4.1 v18.85,19.35 | SH1.P$8 v19.48,3.5 | SH1.P$12 v25.35,3.5 | SH1.P$4 v29.5,7.15
  Top 0.813: R8.1 13,22 13,21.7 SH1.P$10
  Top 1.016: SH1.P$3 27.62,19 | SH1.P$1 11.32,7 v13,7 13,5.38 | SH1.P$5 11.4,14.5 | 20.5,5.38 SH1.P$8 | R14.1 v66.5,34.5
  Bottom 0.25: 25,12 v25.2,11.95 | 18,8 v17.8,7.9
  Bottom 1.016: v66.5,34.5 33.5,34.5
  pour Bottom: 0,37 0,0 34,0 34,37
GND_CABLE  (via drill 0.6)
  Top 0.406: 70.5,17.11 L3.2
  Top 1.016: v66.5,17.11 70.5,17.11
  Bottom 1.016: v66.5,17.11 CON4.2
GNDINT  (via drill 0.6)
  Top 0.813: IC3.4 88.5,32
  Top 1.016: IC3.2 v81.5,32 | R14.2 v76,34.5
  Bottom 1.016: CON2.7 67.5,1.73 | v81.5,32 76.78,32 C9.- v76,34.5
  other vias: 83,26.5 89.5,35 91.5,32 89.5,29 92,30 66.5,2 68,2 69.5,2 71,2 72.5,2 74,2 75.5,2 77,2 78.5,2 80,2 81.5,2 83,2 84.5,2 86,2 87.5,2 66.5,3.5 66.5,5 67.5,6.5 69,8 69.5,9.5 69.5,11 69.5,12.5 69.5,14 69.5,15.5 71,15.5 72.5,15.5 72.5,14 72.5,12.5 74.5,11 74.5,12.5 76.4,12.75 74.5,9.5 76,9 77.5,9 79,9 80.5,9 82,9 83,8 83,6.5 83,5 83,3.5 88,10.5 89.5,10.5 91,10.5 92.5,10.5 94,10.5 95,9.5 96.5,9.5 98,9.5 98,11 98,12.5 98,14 98,15.5 98,17 98,18.5 98,20 98,21.5 98,23 98,24.5 98,26 98,27.5 97,28.5 95.5,28.5 92,34 89,2 88,6 88,4.5 88,7.5 88,9 81.5,26.5 81.5,25 82,23.5 83.25,22.25 83.25,24.75 85.5,25.5 88,24.5 88,23 88,21.5 88,20 91.5,3.5 91.5,5 91.5,6.5 92.5,7.5 93.5,8.5 75.4,18.25 76.9,16.25 75.4,16.25 79.9,16.25 79.9,14.5 81.4,12.5 82.9,12.5 84.4,13.5 85.9,13.5 87.4,13.5 88.9,13.5 91.45,13.35 93.9,13.75 93.9,15.25 88.9,15.25 87.4,15.25 85.9,15.25 84.4,15.75 77.9,20.25 74.4,26.25 75.9,26.25 77.4,26.25 78.4,25.25 78.4,23.75 78.4,22.25 69.65,26.5 68.15,25 66.4,23.5 90.5,2 79.9,12.5 94,28.5 92,28.5 89.5,20 91.25,20 92.75,20 94.5,20 96.25,20 70.65,22.75 70.65,21.5 72.2,21.35 73.9,21.4 75.35,21.35 76.9,21.35 79.65,21.25 80.9,20.25 81.9,19.25 82.9,18.25 78.9,19.25 79.9,18.25 82.9,16.75 85.5,27.75 87,27.75 88.5,27.75
  pour Bottom: 65,27 65.5,0 100,0 100,37 84.5,37 84.5,27
  pour Top: 65.5,0 100,0 100,37 84.5,37 84.5,27 65.5,27
LOL
  Top 0.254: IC2.18 12.5,16.21
  Top 0.305: 12.5,16.21 12,16.75 10,16.75
  Top 0.61: R7.2 9.3,16.75 10,16.75
N$1
  Top 0.813: PWR.A 72.55,23 R15.2
N$11
  Top 0.61: LLK.C 9.3,23.75 R7.1
RO_CLK
  Top 0.406: 16.5,21 15.5,20 C3.2 | 16.49,28.14 16.5,28.14 17.5,29.14 IC1.2 | 16.49,28.14 13,28.14 13,27.5 | 16.49,23.36 16.49,28.14
  Top 0.61: 16.49,21.01 16.5,21
  Top 0.813: 16.49,23.36 16.49,21.01 | R9.1 13,27.5 R8.2
RST
  Top 0.254: IC2.1 21.5,11.5 21.5,9
  Top 0.305: 21.5,9 R10.1
  Top 0.4: 22,9 R10.1
  Top 0.406: 22,9 C8.2
VDD  (via drill 0.6)
  Top 0.254: IC2.32 18,10 18.5,10 | 18.5,10 IC2.33 | 18.5,10 18.5,9 C5.2 | IC2.5 21.5,13.5 | IC2.10 20,17 20.15,17 C4.2 | 14.5,12.5 IC2.25 14,12.5 | IC2.27 14,11.5 14,10 | 14,12 IC2.26
  Top 0.305: 21.5,13.5 22.8,13.5 | 22.8,13.5 C6.2 | 23,20 21.15,20 20.15,19 C4.2 | 22.8,13.5 26.25,13.5 | R10.2 20.35,7 | 18.7,7 18.7,9 C5.2 | 14,11.5 14,12 14,12.5
  Top 0.406: C6.2 C7.2 | 14,10 14,8 v15,7 | v17,7 18.7,7
  Top 0.61: 23,20 23.5,20.5 26.25,20.5 26.25,16.5 | 26.25,16.5 26.25,13.5 26.25,7 20.35,7 18.7,7 | 26.25,16.5 L2.2 29.4,23.5 R12.2
  Bottom 0.406: v15,7 v17,7
VDD_2
  Top 0.406: R6.2 R4.2 R2.2
  Top 0.61: L1.2 13,34.1 | 13,34.1 R9.2 | R6.2 7.2,29.1 12.2,34.1 13,34.1
XA
  Top 0.254: IC2.6 24.55,14 arc90 24.8,14.25 38.4_MHZ.PIN_1
XB
  Top 0.254: IC2.7 22,14.5 22,17.1 arc-90 22.5,17.6 38.4_MHZ.PIN_3

### Text on the board
Top: T
Bottom: B
tNames: TART clock / module / (c)2014
_tsilk: L1 | 1 | 2 | C1 | IC1 | R9 | R13 | R14 | 3 | 4 | C9 | IC3 | R8 | C10 | LLK | R11 | R12 | R15 | PWR | R2 | R4 | R6 | C3 | C4 | L3 | R7 | L2 | C2 | CON3 | CON4 | D1 | C11 | C6 | C12 | IC2 | C7 | R1 | R3 | R5 | C5 | R10 | C8 | IC4 | CON1 | 8 | CON2 | 8 | C13 | SH1 | 1 | 1 | TART clock module (c)2014